# EAGLE design Turnstile_route1 (EAGLE 9.6.2)

## Sheet 1 of 3: CONNECTORS
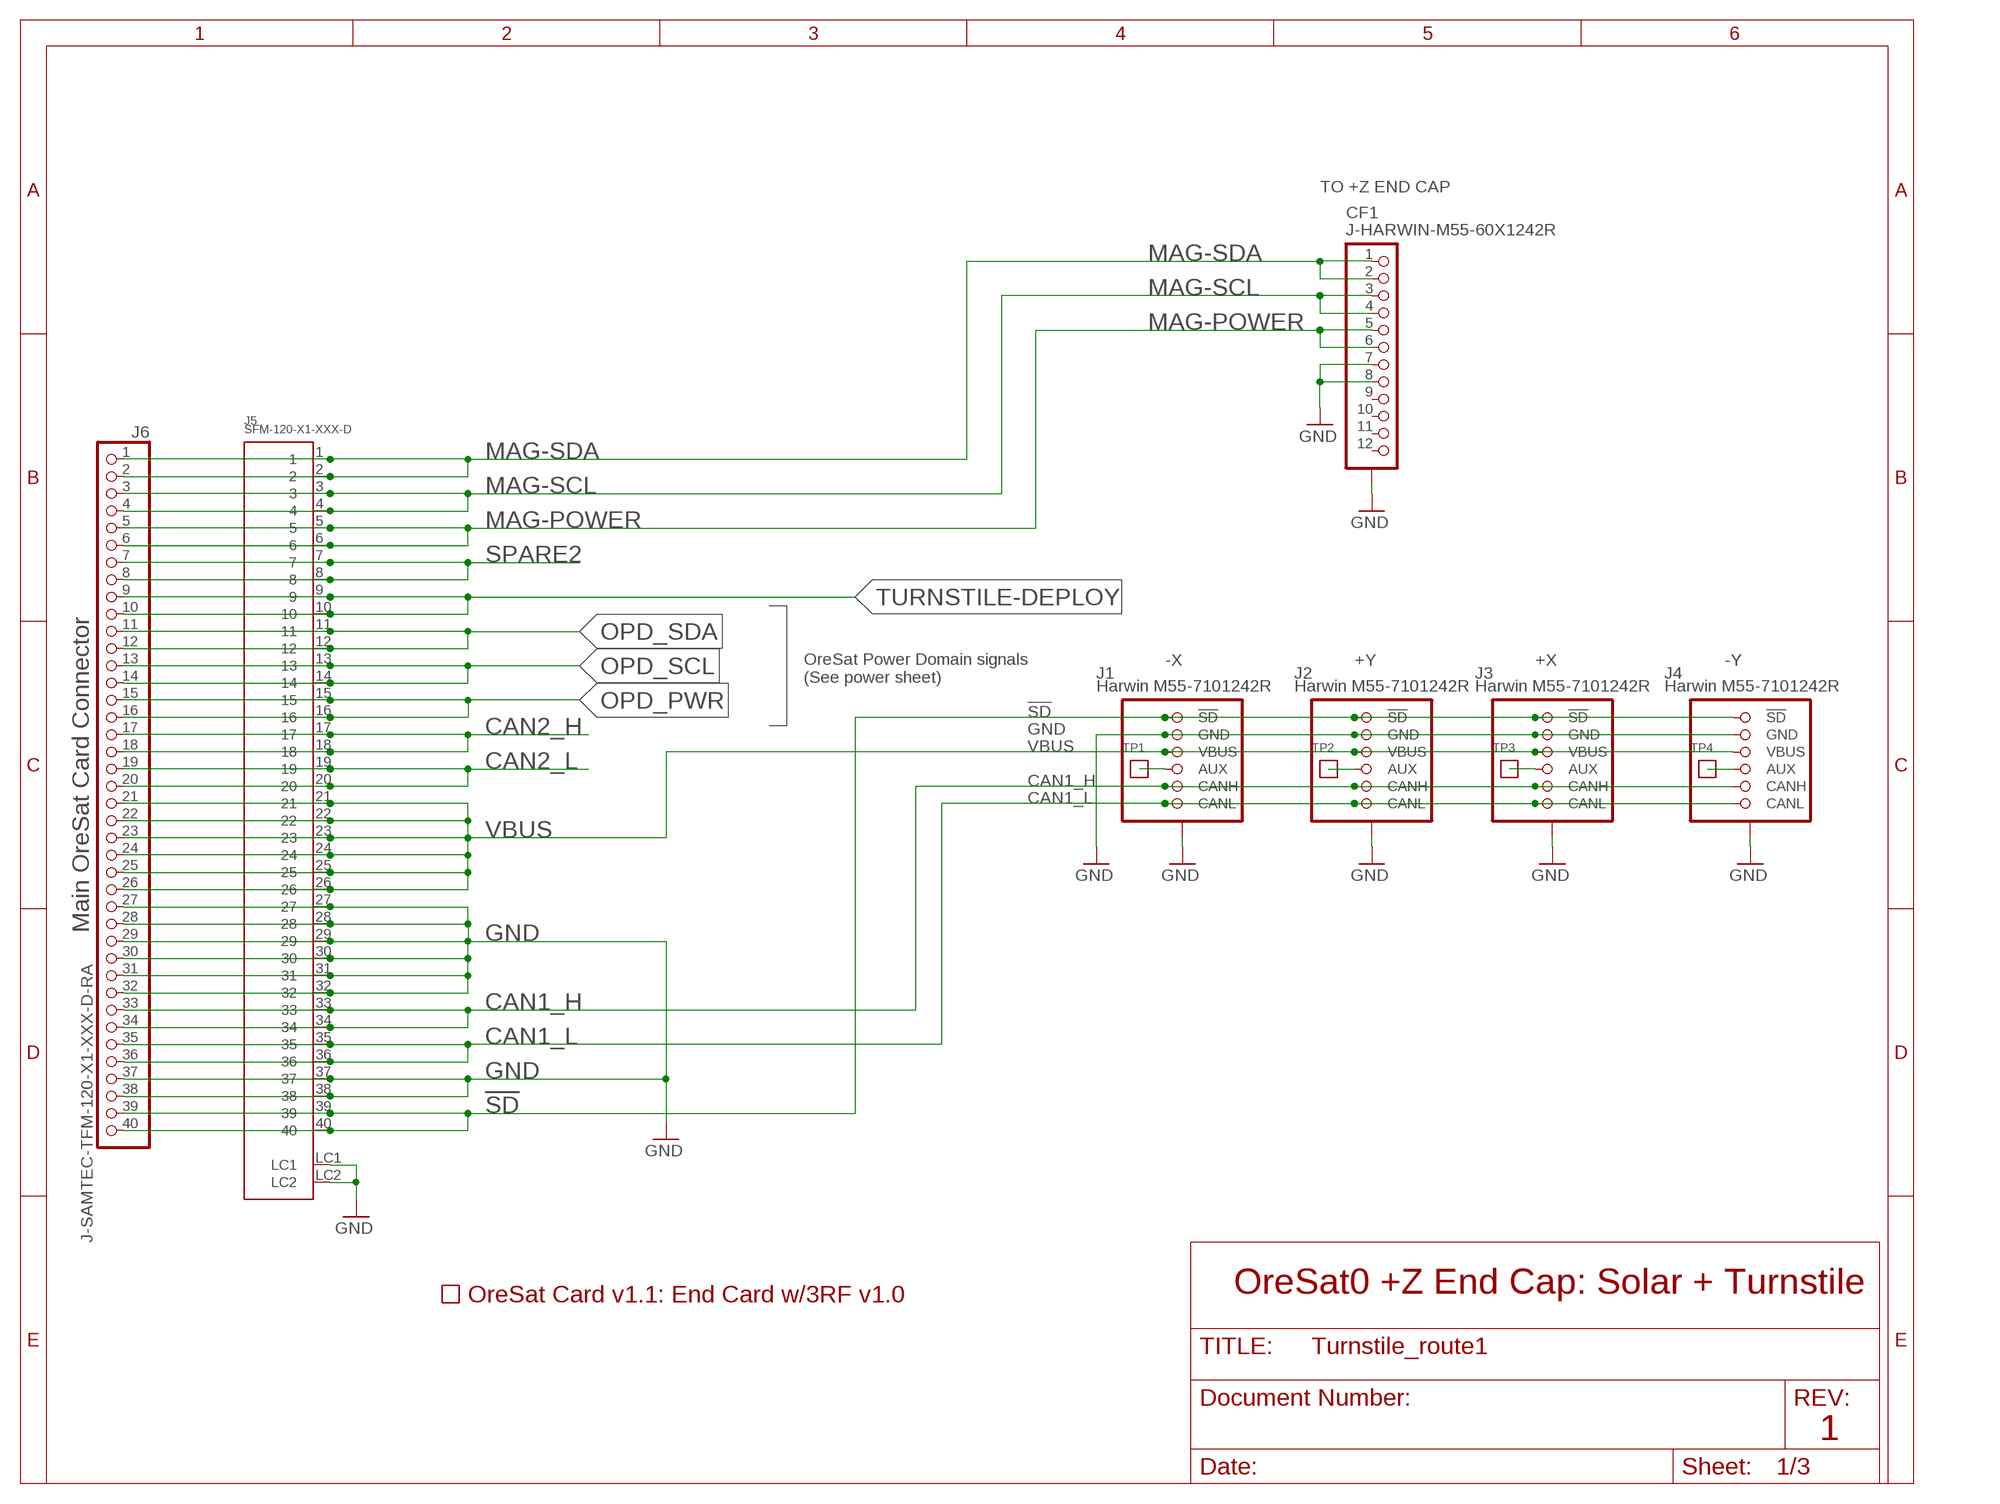
[diagram p0: schematic, sheet 1]

### Parts
CF1  J-HARWIN-M55-60X1242R  [HARWIN-M55-60X1242R]
J1  Harwin M55-7101242R  SOLAR-CARD-CONNECTOR  [M55-7101242R]
J2  Harwin M55-7101242R  SOLAR-CARD-CONNECTOR  [M55-7101242R]
J3  Harwin M55-7101242R  SOLAR-CARD-CONNECTOR  [M55-7101242R]
J4  Harwin M55-7101242R  SOLAR-CARD-CONNECTOR  [M55-7101242R]
J5  SFM-120-X1-XXX-D  [SFM-120-X1-XXX-D]
J6  J-SAMTEC-TFM-120-X1-XXX-D-RA  [J-SAMTEC-TFM-120-X1-XXX-D-RA]
PCB1  ORESAT-CARD-V1.1-END-CARD-3RF-V1.0  [ORESAT-CARDV1.1-END-CARD-3RF-V1.0]
TP1  TEST-POINT-LARGE-SQUARE  [1X01]
TP2  TEST-POINT-LARGE-SQUARE  [1X01]
TP3  TEST-POINT-LARGE-SQUARE  [1X01]
TP4  TEST-POINT-LARGE-SQUARE  [1X01]

### Nets
!SD: J1.1(!SD) J1.2(!SD) J2.1(!SD) J2.2(!SD) J3.1(!SD) J3.2(!SD) J4.1(!SD) J4.2(!SD) J5.39 J5.40 J6.39 J6.40
CAN1_H: J1.9(CANH) J1.10(CANH) J2.9(CANH) J2.10(CANH) J3.9(CANH) J3.10(CANH) J4.9(CANH) J4.10(CANH) J5.33 J5.34 J6.33 J6.34
CAN1_L: J1.11(CANL) J1.12(CANL) J2.11(CANL) J2.12(CANL) J3.11(CANL) J3.12(CANL) J4.11(CANL) J4.12(CANL) J5.35 J5.36 J6.35 J6.36
CAN2_H: J5.17 J5.18 J6.17 J6.18
CAN2_L: J5.19 J5.20 J6.19 J6.20
GND: CF1.7 CF1.8 CF1.P$1(SHIELDS) CF1.P$2(SHIELDS) CF1.P$3(SHIELDS) CF1.P$4(SHIELDS) J1.3(GND) J1.4(GND) J1.P$1(SHIELD) J1.P$2(SHIELD) J1.P$3(SHIELD) J1.P$4(SHIELD) J2.3(GND) J2.4(GND) J2.P$1(SHIELD) J2.P$2(SHIELD) J2.P$3(SHIELD) J2.P$4(SHIELD) J3.3(GND) J3.4(GND) J3.P$1(SHIELD) J3.P$2(SHIELD) J3.P$3(SHIELD) J3.P$4(SHIELD) J4.3(GND) J4.4(GND) J4.P$1(SHIELD) J4.P$2(SHIELD) J4.P$3(SHIELD) J4.P$4(SHIELD) J5.27 J5.28 J5.29 J5.30 J5.31 J5.32 J5.37 J5.38 J5.LC1 J5.LC2 J6.27 J6.28 J6.29 J6.30 J6.31 J6.32 J6.37 J6.38 ; also sheet 2,3
MAG-POWER: CF1.5 CF1.6 J5.5 J5.6 J6.5 J6.6
MAG-SCL: CF1.3 CF1.4 J5.3 J5.4 J6.3 J6.4
MAG-SDA: CF1.1 CF1.2 J5.1 J5.2 J6.1 J6.2
N$7: J1.7(AUX) J1.8(AUX) TP1.1
N$8: J2.7(AUX) J2.8(AUX) TP2.1
N$9: J3.7(AUX) J3.8(AUX) TP3.1
N$10: J4.7(AUX) J4.8(AUX) TP4.1
OPD_PWR: J5.15 J5.16 J6.15 J6.16
OPD_SCL: J5.13 J5.14 J6.13 J6.14
OPD_SDA: J5.11 J5.12 J6.11 J6.12
SPARE2: J5.7 J5.8 J6.7 J6.8
TURNSTILE-DEPLOY: J5.9 J5.10 J6.9 J6.10
VBUS: J1.5(VBUS) J1.6(VBUS) J2.5(VBUS) J2.6(VBUS) J3.5(VBUS) J3.6(VBUS) J4.5(VBUS) J4.6(VBUS) J5.21 J5.22 J5.23 J5.24 J5.25 J5.26 J6.21 J6.22 J6.23 J6.24 J6.25 J6.26
Unconnected: CF1.9 CF1.10 CF1.11 CF1.12

### Notes on the sheet
- TO +Z END CAP
- -X | +Y | +X | -Y
- OreSat Power Domain signals
  (See power sheet)
- Main OreSat Card Connector
- OreSat0 +Z End Cap: Solar + Turnstile
- 1

## Sheet 2 of 3: UHF
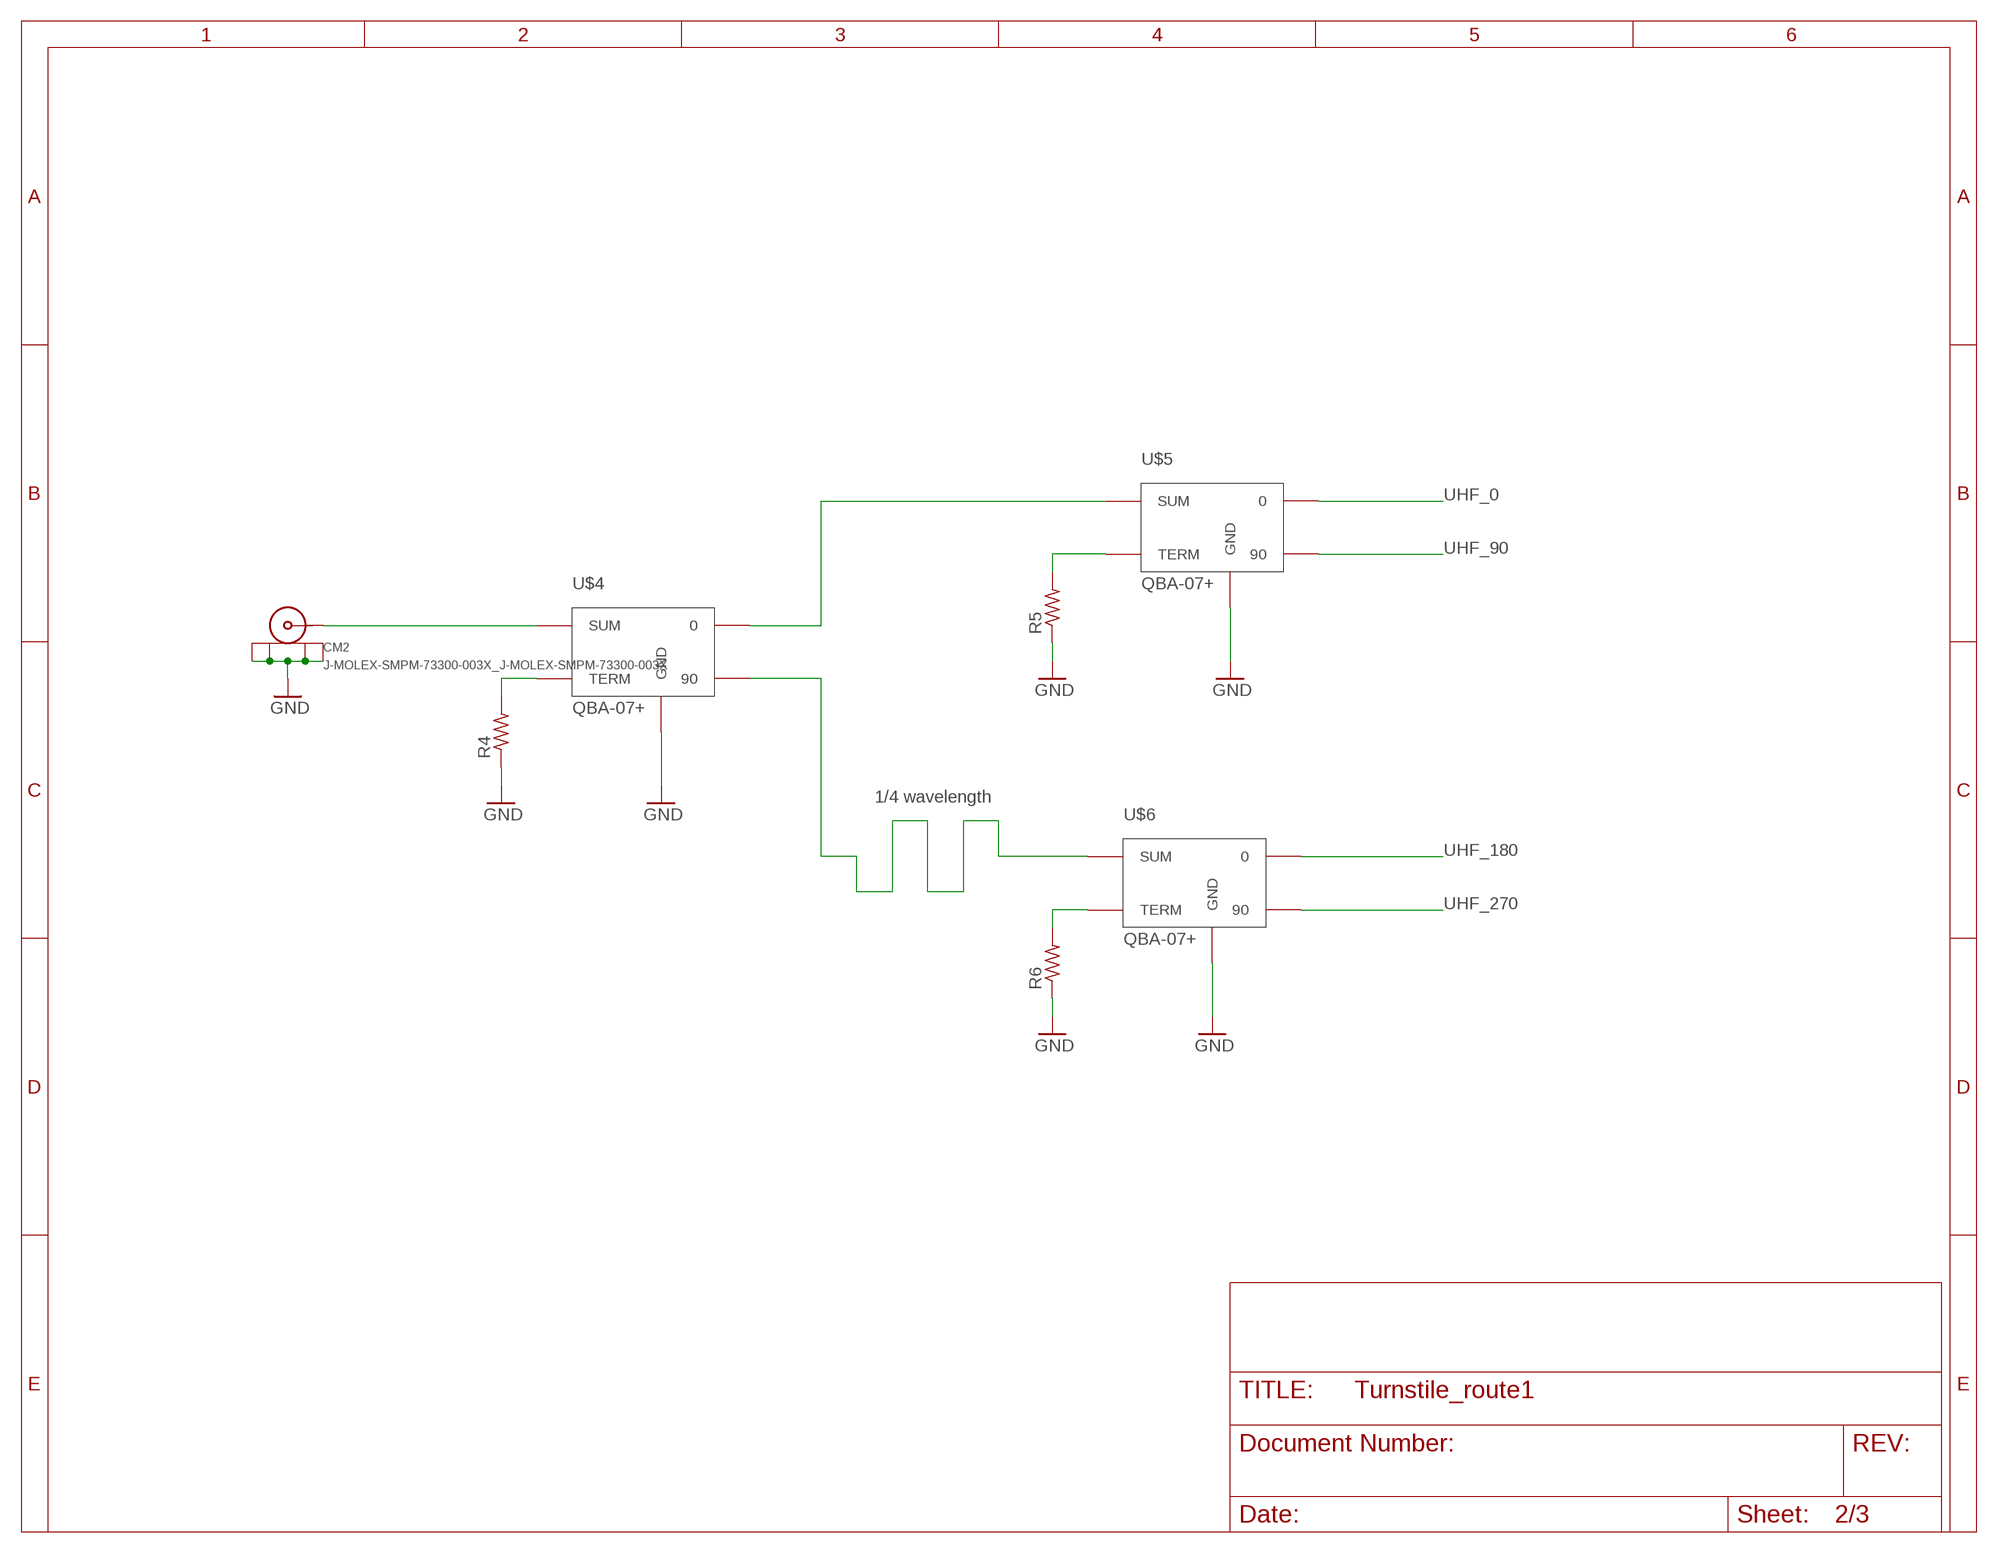
[diagram p1: schematic, sheet 2]

### Parts
CM2  J-MOLEX-SMPM-73300-003X_J-MOLEX-SMPM-73300-003X  [J-MOLEX-SMPM-73300-003X_J-MOLEX-SMPM-073300-003X]
R4  R-US_0402-A-NOSILK  [.0402-A-NOSILK]
R5  R-US_0402-A-NOSILK  [.0402-A-NOSILK]
R6  R-US_0402-A-NOSILK  [.0402-A-NOSILK]
U$4  QBA-07+  [QBA-07+]
U$5  QBA-07+  [QBA-07+]
U$6  QBA-07+  [QBA-07+]

### Nets
GND: CM2.P$1(SHIELD3) CM2.P$2(SHIELD2) CM2.P$3(SHIELD1) CM2.P$4(SHIELD) R4.1 R5.1 R6.1 U$4.P$2(GND) U$4.P$3(GND) U$4.P$4(GND) U$4.P$7(GND) U$4.P$8(GND) U$4.P$9(GND) U$4.P$11(GND) U$5.P$2(GND) U$5.P$3(GND) U$5.P$4(GND) U$5.P$7(GND) U$5.P$8(GND) U$5.P$9(GND) U$5.P$11(GND) U$6.P$2(GND) U$6.P$3(GND) U$6.P$4(GND) U$6.P$7(GND) U$6.P$8(GND) U$6.P$9(GND) U$6.P$11(GND) ; also sheet 1,3
N$19: CM2.RF(CENTER) U$4.P$1(SUM)
N$20: U$4.P$6 U$5.P$1(SUM)
N$21: R4.2 U$4.P$5(TERM)
N$22: R5.2 U$5.P$5(TERM)
N$23: U$4.P$10 U$6.P$1(SUM)
N$24: R6.2 U$6.P$5(TERM)
UHF_0: U$5.P$6
UHF_90: U$5.P$10
UHF_180: U$6.P$6
UHF_270: U$6.P$10

### Notes on the sheet
- 1/4 wavelength

## Sheet 3 of 3: L BAND
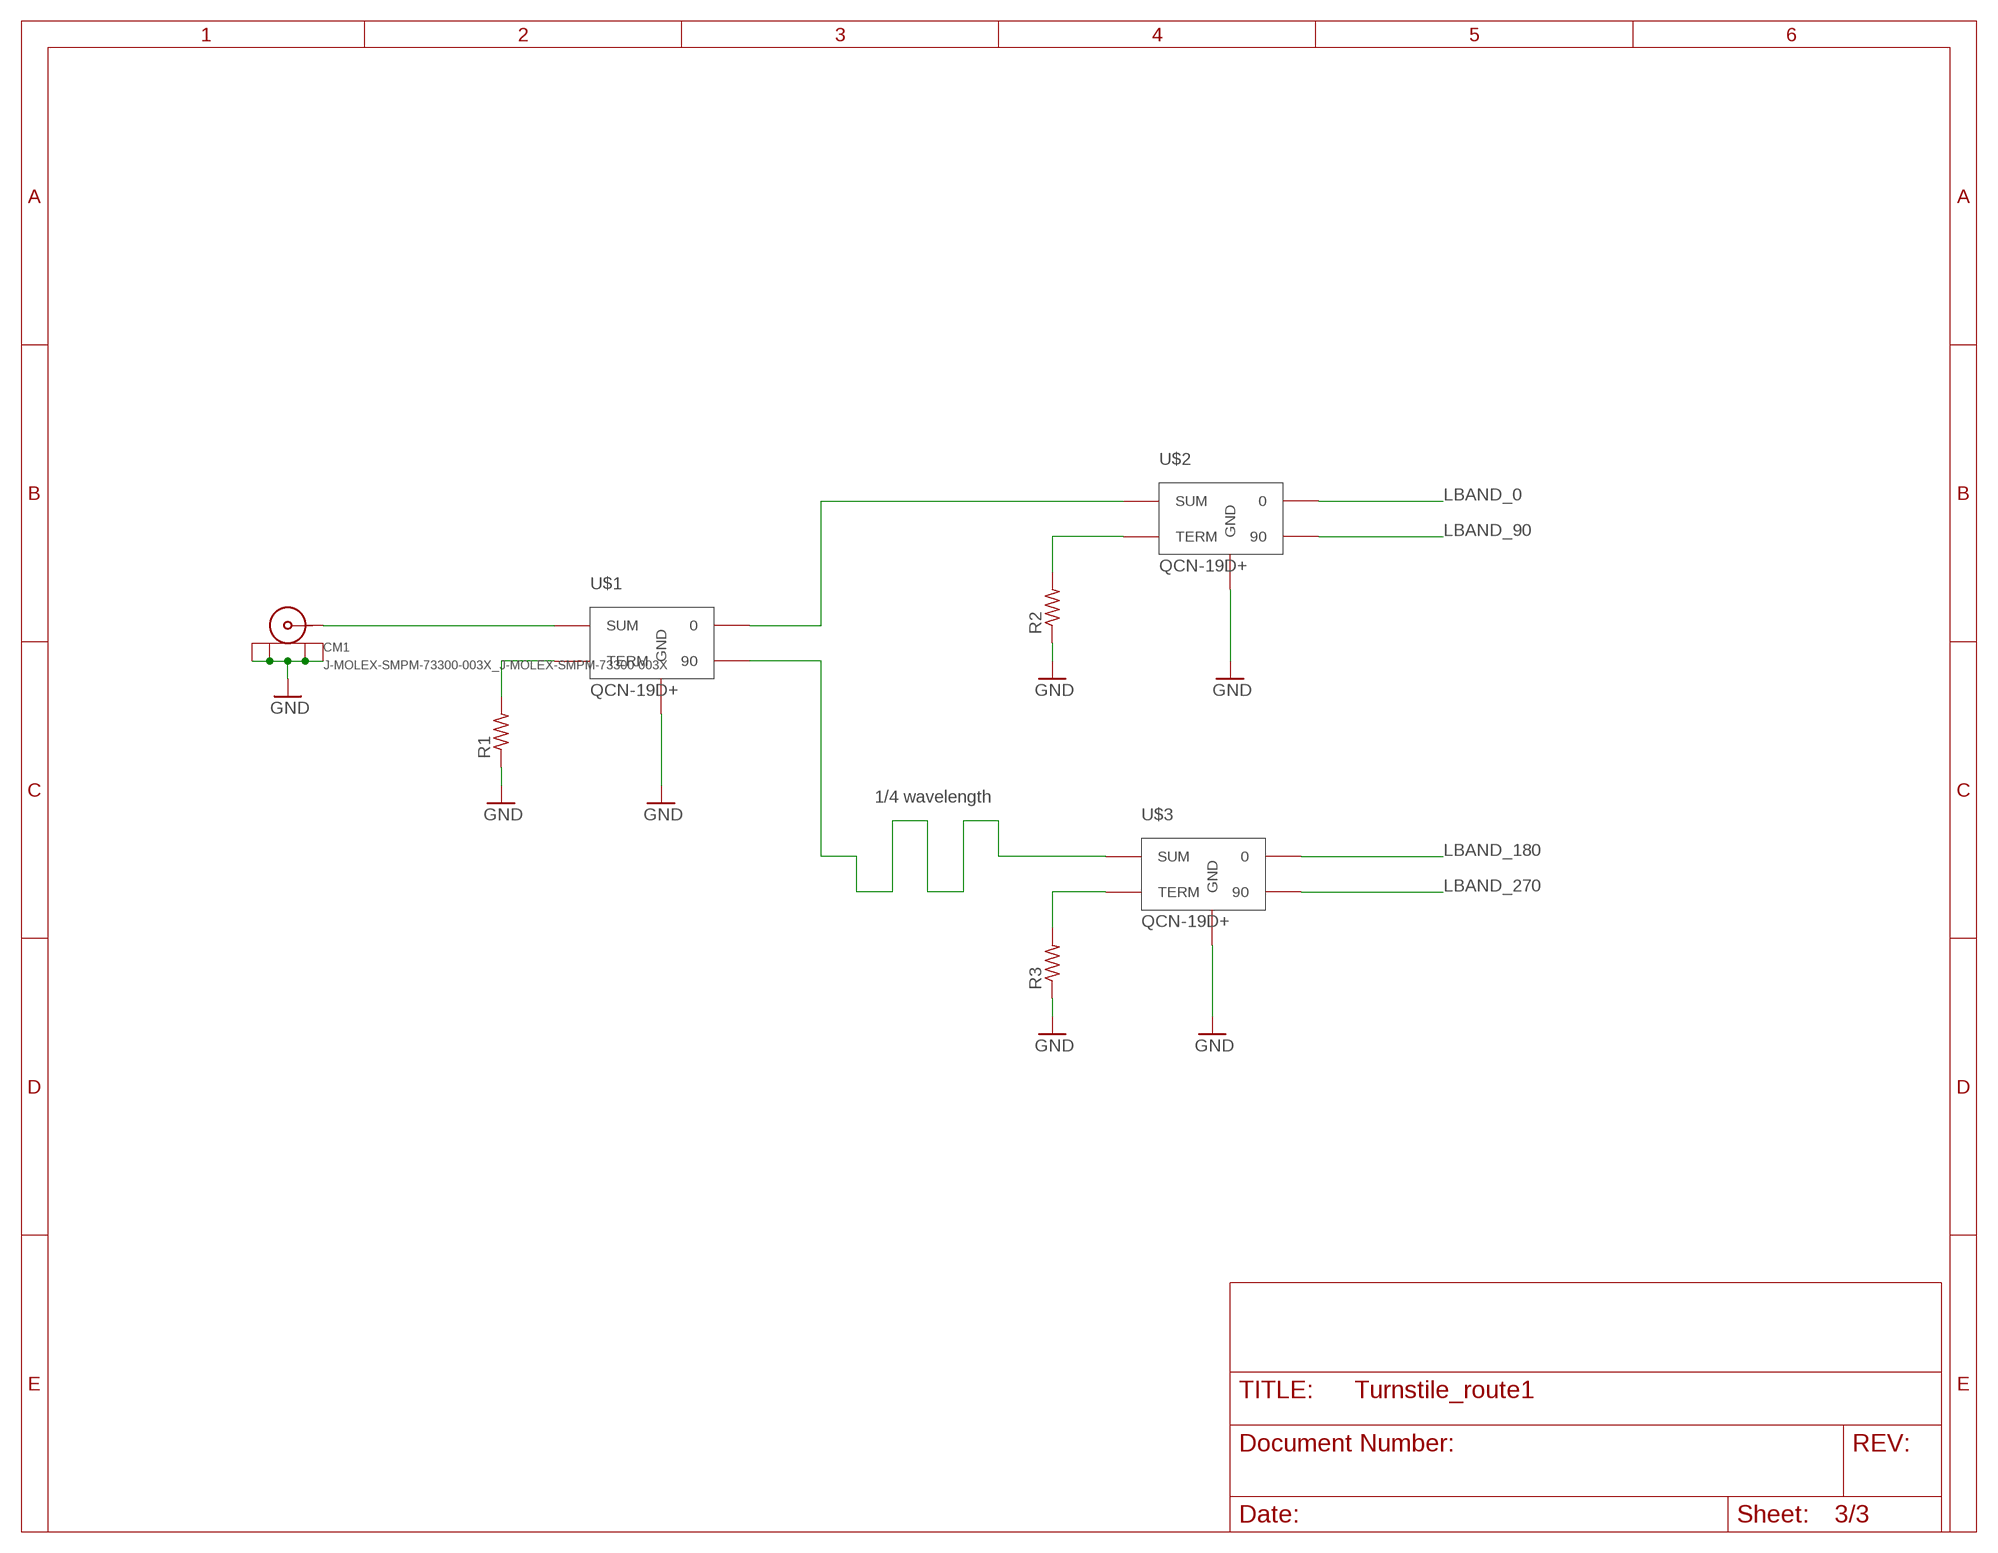
[diagram p2: schematic, sheet 3]

### Parts
CM1  J-MOLEX-SMPM-73300-003X_J-MOLEX-SMPM-73300-003X  [J-MOLEX-SMPM-73300-003X_J-MOLEX-SMPM-073300-003X]
R1  R-US_0402-A-NOSILK  [.0402-A-NOSILK]
R2  R-US_0402-A-NOSILK  [.0402-A-NOSILK]
R3  R-US_0402-A-NOSILK  [.0402-A-NOSILK]
U$1  QCN-19D+  [QVN-19D+]
U$2  QCN-19D+  [QVN-19D+]
U$3  QCN-19D+  [QVN-19D+]

### Nets
GND: CM1.P$1(SHIELD3) CM1.P$2(SHIELD2) CM1.P$3(SHIELD1) CM1.P$4(SHIELD) R1.1 R2.1 R3.1 U$1.P$2(GND) U$1.P$5(GND) U$2.P$2(GND) U$2.P$5(GND) U$3.P$2(GND) U$3.P$5(GND) ; also sheet 1,2
LBAND_0: U$2.P$4
LBAND_90: U$2.P$6
LBAND_180: U$3.P$4
LBAND_270: U$3.P$6
N$1: CM1.RF(CENTER) U$1.P$1(SUM)
N$2: U$1.P$4 U$2.P$1(SUM)
N$3: R1.2 U$1.P$3(TERM)
N$4: R2.2 U$2.P$3(TERM)
N$5: U$1.P$6 U$3.P$1(SUM)
N$6: R3.2 U$3.P$3(TERM)

### Notes on the sheet
- 1/4 wavelength

## Library data of the parts
CF1 = J-Harwin-M55-60X1242R-12pin-1.27mm-F-vertical:J-HARWIN-M55-60X1242R
CM1 CM2 = J-Molex-SMPM-73300-003X:J-MOLEX-SMPM-73300-003X_J-MOLEX-SMPM-73300-003X
J1-J4 = J-Harwin-M55-7101242-Solar-card-connector:SOLAR-CARD-CONNECTOR: OreSat End Card Solar Connector This 12pin 1.27 mm male SMT connector (Harwin M55-7101242R) is used on the end cards to attach to the solar boards. Note: alignment pin hole diameters are 0.05 mm smaller than recommended in order to tighten up connector location; this requires hand placement of this package.
J5 = J-Samtec-SFM-120-X1-XXX-D:SFM-120-X1-XXX-D: 0.05"X0.05" SOCKET STRIP DOUBLE ROW ASSEMBLY. MANUFACTURER: SAMTEC.
J6 = J-Samtec-TFM-120-X1-XXX-D-RA:J-SAMTEC-TFM-120-X1-XXX-D-RA; DIS: Digi-Key; DPN: SAM10145-ND; MFR: Samtec; MPN: TFM-120-01-L-D-RA
PCB1 = oresat-cards:ORESAT-CARD-V1.1-END-CARD-3RF-V1.0
R1-R6 = oresat-rcl:R-US_: RESISTOR, American symbol
TP1-TP4 = oresat-misc:TEST-POINT-LARGE-SQUARE
U$1-U$3 = Mini-Circuits-QCN-19D+_Phase-shifter:QCN-19D+
U$4-U$6 = Mini-Circuits-QBA-07+_Phase-shifter:QBA-07+

## Board
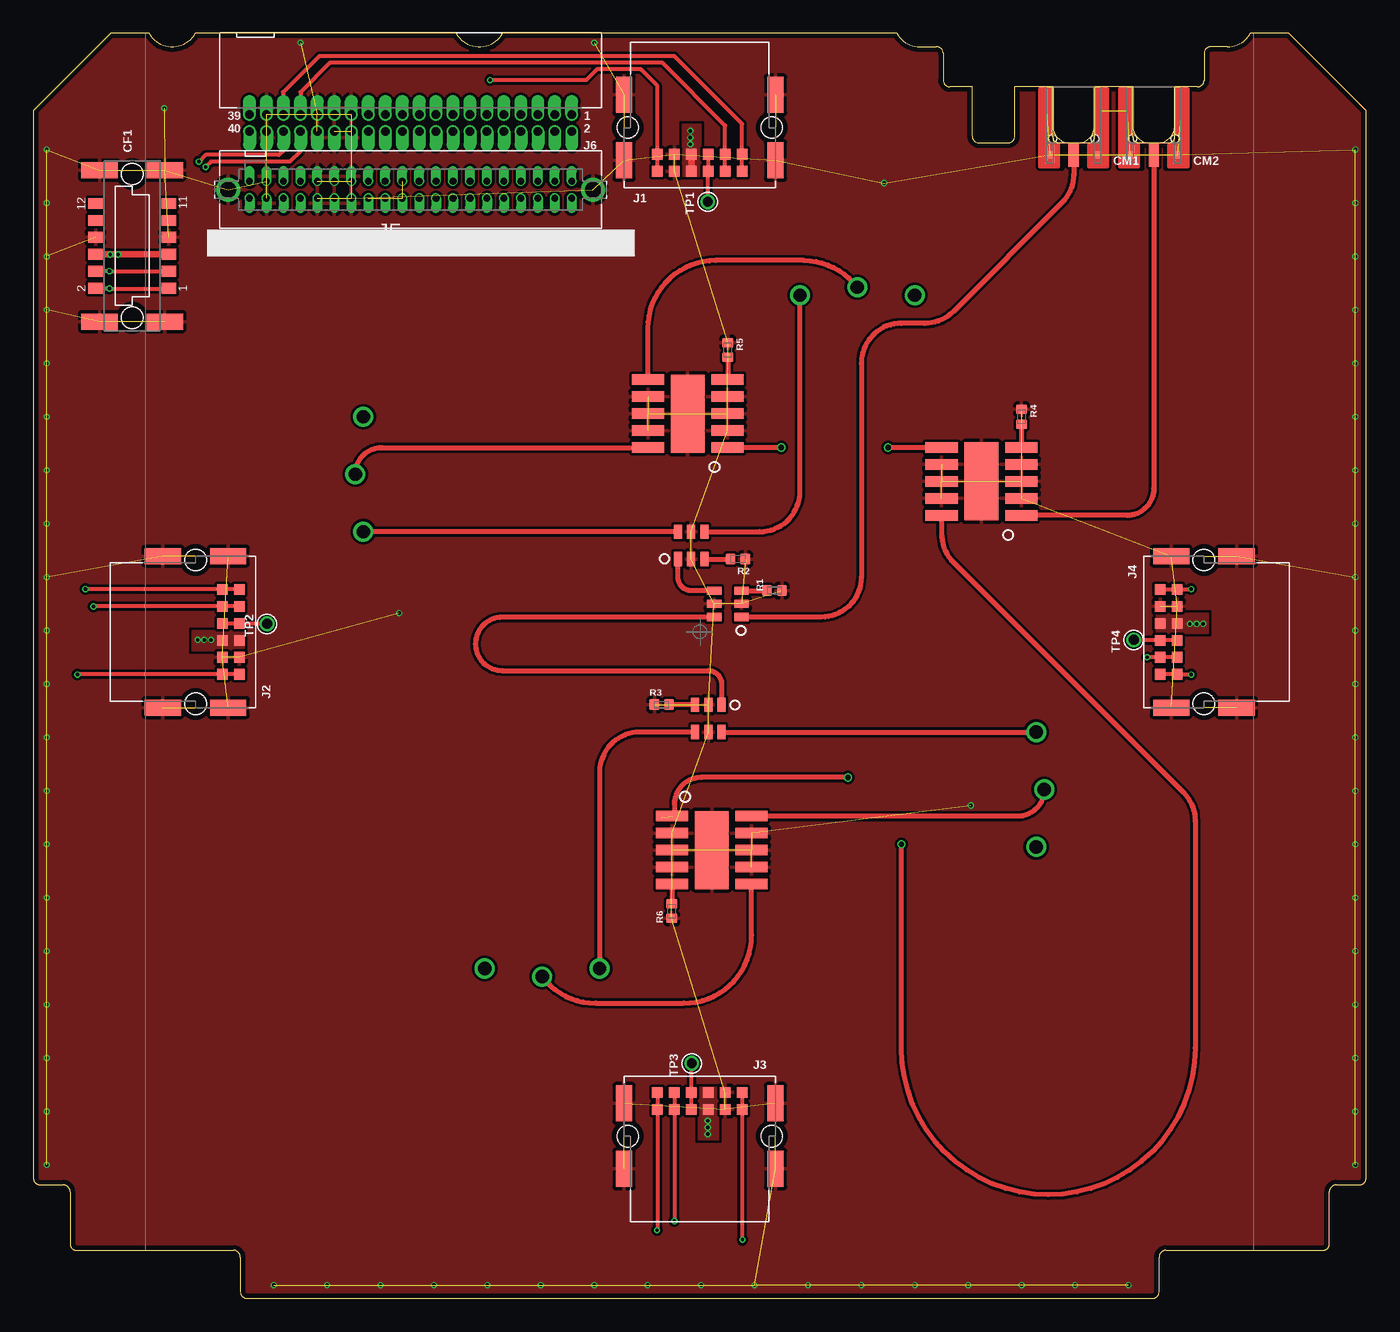
[diagram p3: board, top side]
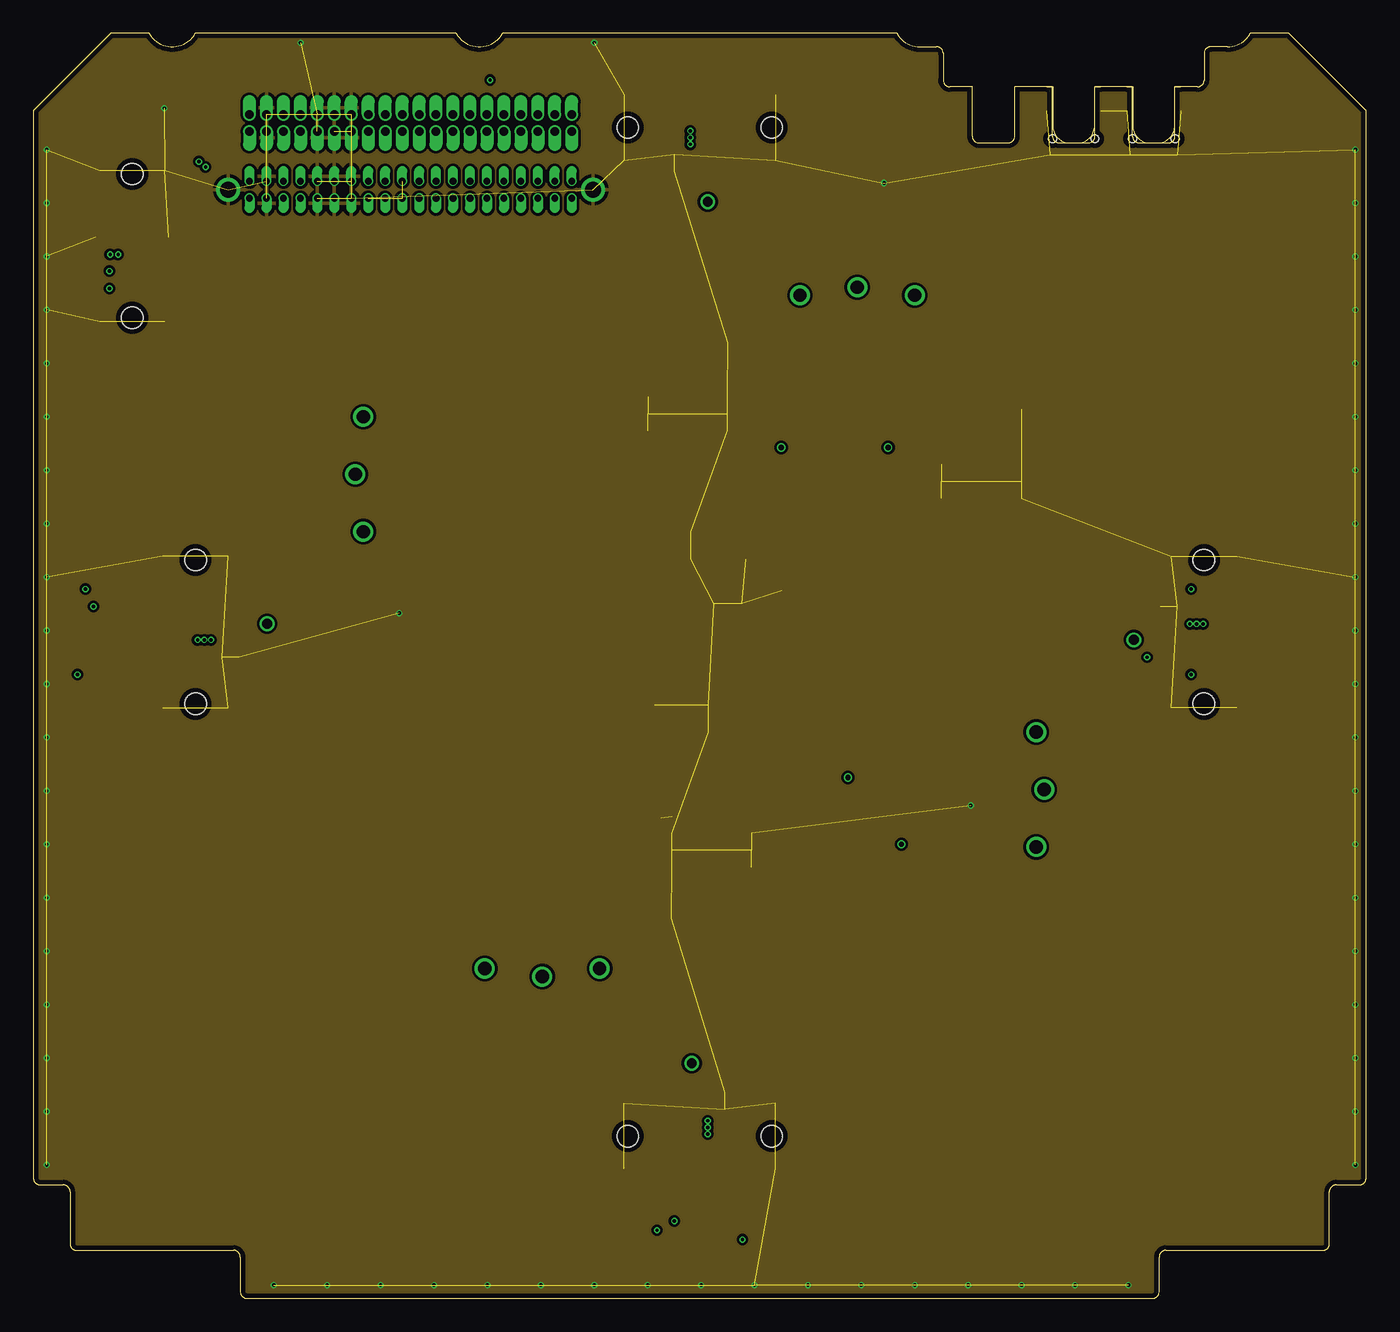
[diagram p4: board, inner layer Route2]
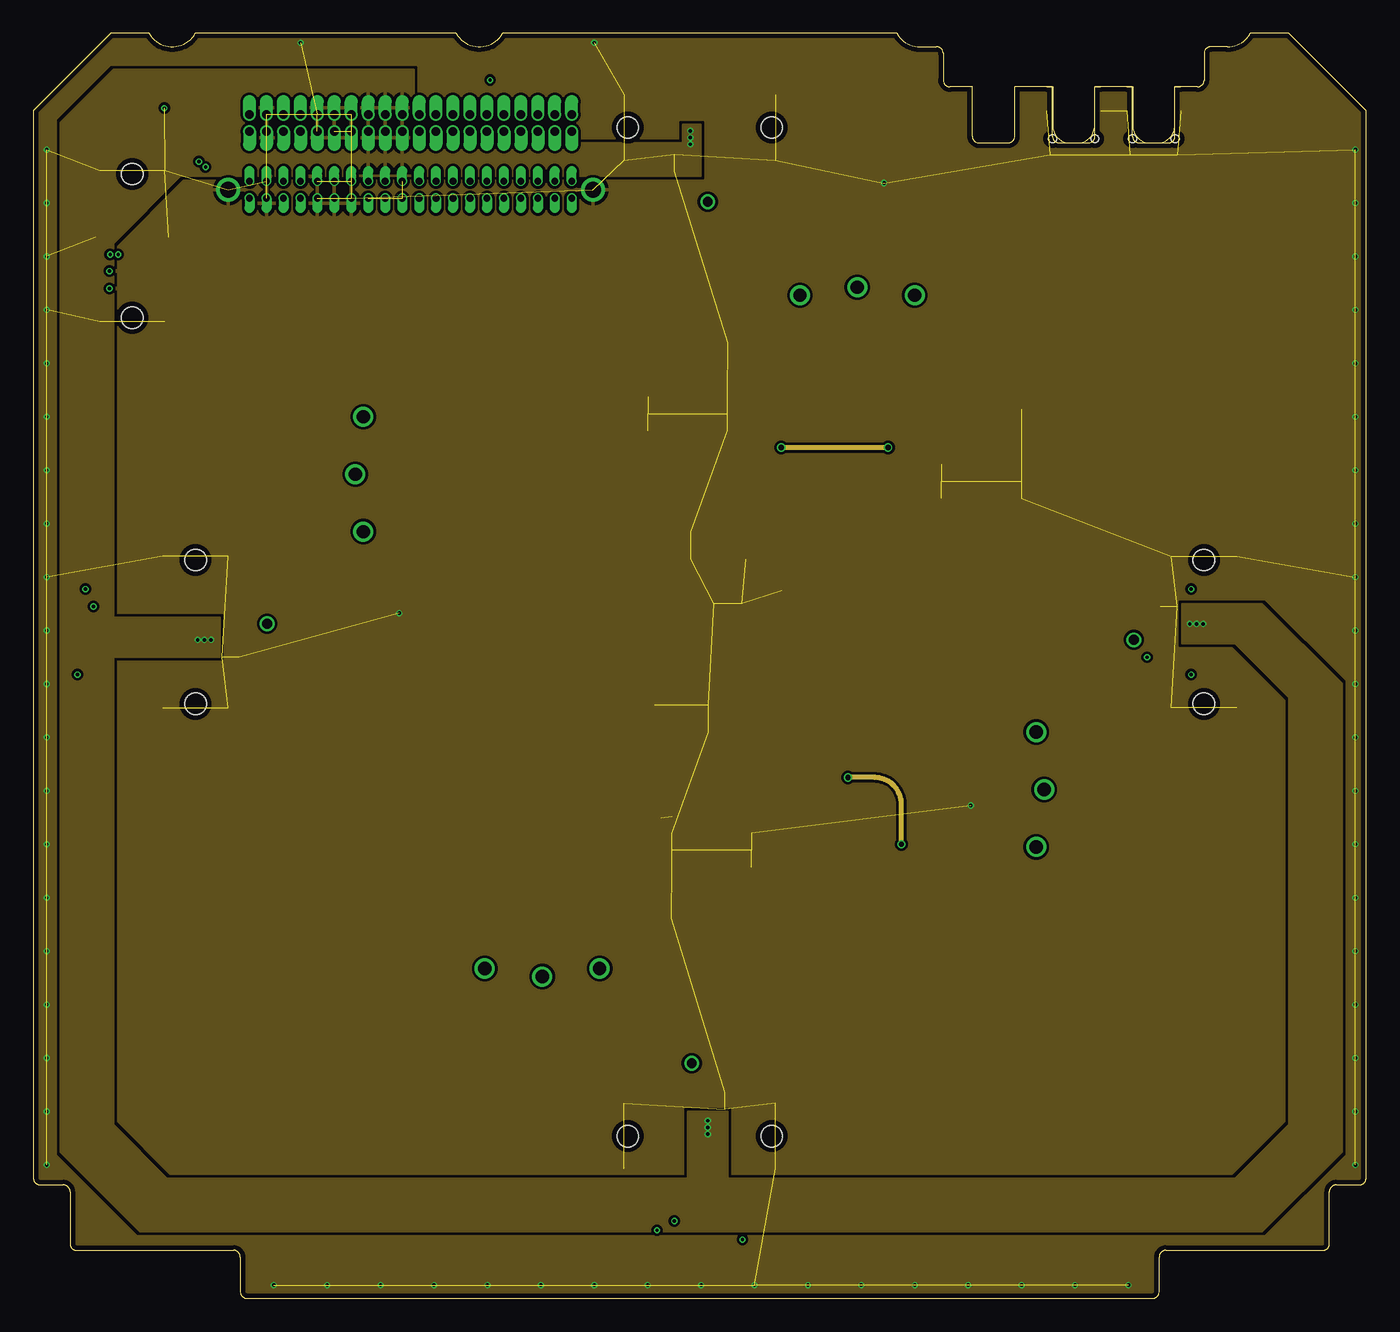
[diagram p5: board, inner layer Route15]
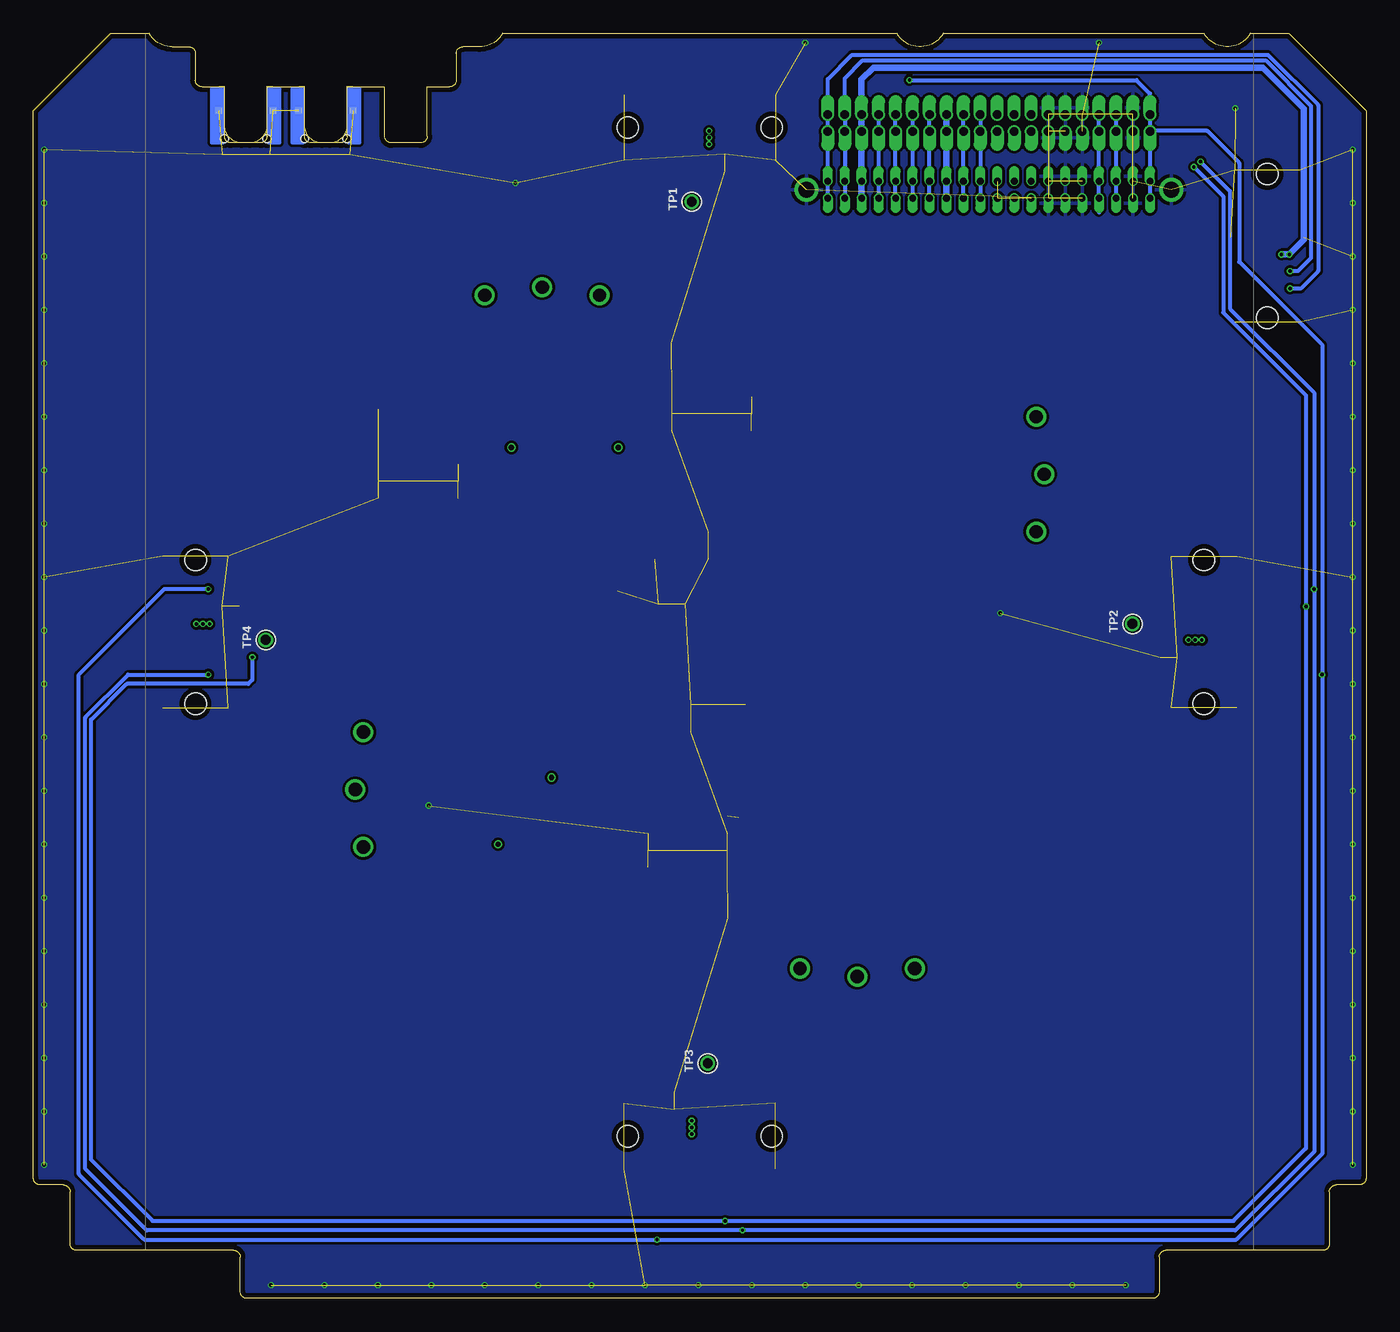
[diagram p6: board, bottom side, seen from below]

Size 99.8 x 94.7 mm. Coordinates in mm from the lower left corner, seen from the top.
Copper layers (1*2*15*16): Top 0.035559375mm / dielectric 0.17018125mm / Route2 0.01778125mm / dielectric 47mil / Route15 0.01778125mm / dielectric 0.17018125mm / Bottom 0.035559375mm
Design rules "oshpark-4layer *": minimum track width 5mil, minimum drill 10mil, track to track 5mil, track to pad 5mil, pad to pad 5mil, via to via 5mil, smd to smd 5mil, copper to edge 15mil, drill to drill 6mil, minimum pad ring 4mil, minimum via ring 4mil, stop-mask expansion 2.5mil, vias tented up to drill 10mil, thermal gap 10mil

### Footprints (pad centres in the part's own frame; a part is rotated, then mirrored left to right if it is on the bottom)
HARWIN-M55-60X1242R = smd 0.8 x 1.1: 1 -3.175,-2.75; 2 -3.175,2.75; 3 -1.905,-2.75; 4 -1.905,2.75; 5 -0.635,-2.75; 6 -0.635,2.75; 7 0.635,-2.75; 8 0.635,2.75; 9 1.905,-2.75; 10 1.905,2.75; 11 3.175,-2.75; 12 3.175,2.75 | smd 1.2 x 2.7: P$1 -5.67,-2.45; P$2 -5.67,2.45; P$3 5.67,2.45; P$4 5.67,-2.45 | hole 1.6: -5.385,0; 5.385,0
J-MOLEX-SMPM-73300-003X_J-MOLEX-SMPM-073300-003X = smd 0.508 x 0.508: P$1 -1.778,-5.08; P$2 1.778,-5.08 | smd 0.508 x 0.508 bottom: P$3 -2.032,-1.778; P$4 2.032,-1.778 | smd 0.762 x 1.778: RF 0,-5.08 | hole 0.61: 1.587,-3.886; -1.587,-3.886
M55-7101242R = smd 0.8 x 0.8: 1 3.175,2; 2 3.175,3.27; 3 1.905,2; 4 1.905,3.27; 5 0.635,2; 6 0.635,3.27; 7 -0.635,2; 8 -0.635,3.27; 9 -1.905,2; 10 -1.905,3.27; 11 -3.175,2; 12 -3.175,3.27 | smd 1.2 x 2.7: P$1 5.67,2.45; P$2 5.67,-2.45; P$3 -5.67,2.45; P$4 -5.67,-2.45 | hole 1.6: 5.385,0; -5.385,0
SFM-120-X1-XXX-D = drill 0.5 offset: 1 12.065,-0.635; 2 12.065,0.635; 3 10.795,-0.635; 4 10.795,0.635; 5 9.525,-0.635; 6 9.525,0.635; 7 8.255,-0.635; 8 8.255,0.635; 9 6.985,-0.635; 10 6.985,0.635; 11 5.715,-0.635; 12 5.715,0.635; 13 4.445,-0.635; 14 4.445,0.635; 15 3.175,-0.635; 16 3.175,0.635; 17 1.905,-0.635; 18 1.905,0.635; 19 0.635,-0.635; 20 0.635,0.635; 21 -0.635,-0.635; 22 -0.635,0.635; 23 -1.905,-0.635; 24 -1.905,0.635; 25 -3.175,-0.635; 26 -3.175,0.635; 27 -4.445,-0.635; 28 -4.445,0.635; 29 -5.715,-0.635; 30 -5.715,0.635; 31 -6.985,-0.635; 32 -6.985,0.635; 33 -8.255,-0.635; 34 -8.255,0.635; 35 -9.525,-0.635; 36 -9.525,0.635; 37 -10.795,-0.635; 38 -10.795,0.635; 39 -12.065,-0.635; 40 -12.065,0.635 | drill 1.194: LC1 13.652,0; LC2 -13.652,0
J-SAMTEC-TFM-120-X1-XXX-D-RA = drill 0.635 pad 0.965 offset: 1 12.065,0.635; 2 12.065,-0.635; 3 10.795,0.635; 4 10.795,-0.635; 5 9.525,0.635; 6 9.525,-0.635; 7 8.255,0.635; 8 8.255,-0.635; 9 6.985,0.635; 10 6.985,-0.635; 11 5.715,0.635; 12 5.715,-0.635; 13 4.445,0.635; 14 4.445,-0.635; 15 3.175,0.635; 16 3.175,-0.635; 17 1.905,0.635; 18 1.905,-0.635; 19 0.635,0.635; 20 0.635,-0.635; 21 -0.635,0.635; 22 -0.635,-0.635; 23 -1.905,0.635; 24 -1.905,-0.635; 25 -3.175,0.635; 26 -3.175,-0.635; 27 -4.445,0.635; 28 -4.445,-0.635; 29 -5.715,0.635; 30 -5.715,-0.635; 31 -6.985,0.635; 32 -6.985,-0.635; 33 -8.255,0.635; 34 -8.255,-0.635; 35 -9.525,0.635; 36 -9.525,-0.635; 37 -10.795,0.635; 38 -10.795,-0.635; 39 -12.065,0.635; 40 -12.065,-0.635
.0402-A-NOSILK = smd 0.7 x 0.8: 1 -0.55,0; 2 0.55,0
1X01 = drill 0.737 pad 1.1: 1 0,0
QVN-19D+ = smd 0.61 x 1.07: P$1 -0.99,-1.025; P$2 0,-1.025; P$3 0.99,-1.025; P$4 0.99,1.025; P$5 0,1.025; P$6 -0.99,1.025
QBA-07+ = smd 0.79 x 2.41: P$1 -2.54,-2.985; P$2 -1.27,-2.985; P$3 0,-2.985; P$4 1.27,-2.985; P$5 2.54,-2.985; P$6 2.54,2.985; P$7 1.27,2.985; P$8 0,2.985; P$9 -1.27,2.985; P$10 -2.54,2.985 | smd 5.84 x 2.54: P$11 0,0

### Placement (x,y rotation side)
CF1  7.4,78.8 90 top
CM1  77.9,90.7 0 top
CM2  83.9,90.7 0 top
J1  49.9,87.65 180 top
J2  12.15,49.9 270 top
J3  49.9,12.15 0 top
J4  87.65,49.9 90 top
J5  28.25,83 0 top
J6  28.25,88 0 top
PCB1  0,0 0 top
R1  55.5,52.99 180 top
R2  52.76,55.35 180 top
R3  47.04,44.45 0 top
R4  74,66 270 top
R5  52,71 270 top
R6  47.8,29 90 top
TP1  50.5,82.1 90 top
TP2  17.5,50.5 90 top
TP3  49.3,17.6 90 top
TP4  82.4,49.3 90 top
U$1  52,52 90 top
U$2  49.26,56.38 0 top
U$3  50.54,43.42 180 top
U$4  71,61.16 90 top
U$5  49,66.24 90 top
U$6  50.8,33.56 270 top

### Tracks (layer width: path | path; a pad name or v marks a point on that pad's centre or on a via)
!SD  (via drill 0.25)
  Top 0.3: J1.2 J1.1 46.73,90.78 45.5,92 42.2,92 41.4,91.2 v34.2,91.2 | J2.2 J2.1 3.33,46.73 v3.3,46.7 | J3.2 J3.1 53.08,4.3 53.1,4.3 v53.1,4.4 | J4.2 J4.1 86.7,53.08 v86.7,53.1
  Bottom 0.3: J6.40 J6.39 16.18,90.19 17.2,91.2 v34.2,91.2 | J6.40 J5.40 J5.39 | v86.7,53.1 90,53.1 96.4,46.7 96.4,9.3 91.5,4.4 v53.1,4.4 9.73,4.4 3.3,10.83 v3.3,46.7 3.3,71.4 9.5,77.6 9.5,85 11.9,87.4 16.15,87.4 J6.40
CAN1_H  (via drill 0.25)
  Top 0.3: J1.10 J1.9 51.8,87.8 47.1,92.5 22.2,92.5 20,90.3 J6.33 | J2.10 J2.9 v4.5,51.8 | J3.10 J3.9 v47.99,5.8 v48,5.8 | J4.9 J4.10 v83.4,47.99 v83.4,48 | J6.34 20,85.89 19.2,85.1 13.3,85.1 v12.9,84.7
  Bottom 0.3: J6.33 J6.34 J5.34 J5.33 20,81.3 | v83.4,48 83.4,46.3 83.7,46 92.8,46 95.47,43.32 95.47,10.4 90.87,5.8 v48,5.8 9.93,5.8 4.5,11.23 v4.5,51.8 4.5,67.6 10.7,73.8 10.7,82.5 v12.9,84.7
CAN1_L  (via drill 0.25)
  Top 0.3: J1.12 J1.11 53.08,87.92 48,93 21.4,93 18.7,90.3 18.7,88.66 J6.35 | J2.12 J2.11 3.92,53.08 v3.9,53.1 | J3.12 J3.11 46.73,5.11 v46.7,5.11 | v86.7,46.7 85.65,46.7 J4.11 J4.12 | J6.36 18.73,85.92 18.4,85.6 12.9,85.6 v12.4,85.1
  Bottom 0.3: J6.35 J6.36 J5.36 J5.35 | v86.7,46.7 92.7,46.7 95.9,43.5 95.9,9.7 91.3,5.1 v46.7,5.1 | v46.7,5.1 9.8,5.1 3.9,11 v3.9,53.1 3.9,67.8 10.2,74.1 10.2,82.9 v12.4,85.1 | v46.7,5.11 v46.7,5.1
CAN2_H
  Bottom 0.3: J5.17 J5.18 J6.18 J6.17
CAN2_L
  Bottom 0.3: J6.19 J6.20 J5.20 J5.19
GND  (via drill 0.25)  (151 unrouted)
  other vias: 1,10 1,14 1,18 1,22 1,26 1,30 1,34 1,38 1,42 1,46 1,50 1,54 1,58 1,62 1,66 1,70 1,74 1,78 1,82 1,86 99,10 99,14 99,18 99,22 99,26 99,30 99,34 99,38 99,42 99,46 99,50 99,54 99,58 99,62 99,66 99,70 99,74 99,78 99,82 99,86 18,1 22,1 26,1 30,1 34,1 38,1 42,1 46,1 50,1 54,1 58,1 62,1 66,1 70,1 74,1 78,1 82,1 27.4,51.3 70.2,36.9 63.7,83.5 9.8,89.1 20,94 42,94
  pour Top (isolate 0.2, rank 6): 0,0 0,94.7 99.8,94.7 99.8,0
  pour Bottom (isolate 0.2, rank 6): 0,0 0,94.7 99.8,94.7 99.8,0
  pour Route2 (isolate 0.2, rank 6): 0,0 0,94.7 99.8,94.7 99.8,0
  pour Route15 (isolate 0.2, rank 6): 0,0 0,94.7 99.8,94.7 99.8,0
LBAND_0  (via drill 1)
  Top 0.38: U$2.P$4 54.4,57.4 arc90 57.4,60.4 v57.4,75.1
LBAND_90  (via drill 1)
  Top 0.38: U$2.P$6 v24.7,57.4
LBAND_180  (via drill 1)
  Top 0.38: U$3.P$4 45.4,42.4 arc90 42.4,39.4 v42.4,24.7
LBAND_270  (via drill 1)
  Top 0.38: U$3.P$6 v75.1,42.4
MAG-POWER  (via drill 0.25)
  Top 0.5: CF1.5 10.13,78.15 v5.75,78.15 4.67,78.15 CF1.6
  Bottom 0.5: J5.5 J5.6 J6.6 J6.5 37.77,91.27 36.9,92.15 22.2,92.15 21.9,92.15 7.75,92.15 4.65,89.06 4.65,79.25 v5.75,78.15 v6.35,78.15
MAG-SCL  (via drill 0.25)
  Top 0.3: CF1.4 v5.7,76.9 CF1.3
  Bottom 0.3: J5.3 J5.4 J6.4 J6.3 39.05,91.33 37.7,92.67 22.2,92.67 7.53,92.67 4.13,89.27 4.13,77.87 5.1,76.9 v5.7,76.9
MAG-SDA  (via drill 0.25)
  Top 0.3: CF1.2 4.67,75.6 v5.7,75.6 10.12,75.6 CF1.1
  Bottom 0.3: J5.1 J5.2 J6.2 J6.1 40.31,91.28 38.5,93.1 7.35,93.1 3.6,89.35 3.6,76.9 4.9,75.6 v5.7,75.6
N$1
  Top 0.38: CM1.RF 77.9,84.14 arc-45 77.02,82.02 68.88,73.88 arc-45 66.76,73 65,73 arc90 62,70 62,54.01 arc-90 59,51.01 U$1.P$1
N$2
  Top 0.38: U$1.P$4 49.27,52.99 arc-90 48.27,53.99 U$2.P$1
N$3
  Top 0.38: U$1.P$3 R1.2
N$4
  Top 0.38: U$2.P$3 R2.2
N$5
  Top 0.38: U$1.P$6 35.11,51 arc180 35.11,47 50.53,47 arc-90 51.53,46 U$3.P$1
N$6
  Top 0.38: U$3.P$3 R3.2
N$7
  Top 0.3: J1.7 J1.8 50.5,84.34 TP1.1
N$8
  Top 0.3: J2.7 J2.8 17.46,50.53 TP2.1
N$9
  Top 0.3: J3.7 J3.8 49.27,17.6 TP3.1
N$10
  Top 0.3: J4.7 J4.8 82.4,49.27 TP4.1
N$11  (via drill 1)
  other vias: 66,75.1
N$14  (via drill 1)
  other vias: 33.8,24.7
N$17  (via drill 1)
  other vias: 75.1,33.8
N$19
  Top 0.38: CM2.RF 83.9,60.62 arc-90 81.9,58.62 U$4.P$1
N$20  (via drill 0.4)
  Top 0.38: U$4.P$6 v64,63.7 | v56,63.7 U$5.P$1
  Route15 0.38: v64,63.7 v56,63.7
N$21
  Top 0.38: R4.2 74,63.72 arc-90 U$4.P$5
N$22
  Top 0.38: R5.2 52,68.8 arc-90 U$5.P$5
N$23  (via drill 0.4)  (1 unrouted)
  Top 0.38: U$4.P$10 68.02,57.23 arc45 68.89,55.11 86.12,37.88 arc-45 87,35.76 87,18.77 arc-180 65,18.77 v65,34 | 47,36 48,36 48,37 arc-90 50,39 v61,39
  Route15 0.38: v65,34 65,37 arc90 63,39 v61,39
N$24
  Top 0.38: U$6.P$5 47.81,29.57 arc-90 R6.2
N$26  (via drill 1)
  other vias: 24.7,66
OPD_PWR
  Bottom 0.5: J6.15 J6.16 J5.16 J5.15
OPD_SCL
  Bottom 0.3: J5.13 J5.14 J6.14 J6.13
OPD_SDA
  Bottom 0.3: J6.11 J6.12 J5.12 J5.11
SPARE2
  Bottom 0.3: J6.7 J6.8 J5.8 J5.7
TURNSTILE-DEPLOY
  Bottom 0.3: J5.9 J5.10 J6.10 J6.9
UHF_0  (via drill 1)
  Top 0.38: v61.7,75.7 arc53 57.7,77.7 51.09,77.7 arc90 46,72.61 46,68.8 arc90 U$5.P$6
UHF_90  (via drill 1)
  Top 0.38: v24.1,61.7 arc-90 26.1,63.7 U$5.P$10
UHF_180  (via drill 1)
  Top 0.38: v38.1,24.1 arc53 42.1,22.1 48.69,22.1 arc90 53.78,27.19 U$6.P$6
UHF_270  (via drill 1)
  Top 0.38: v75.7,38.1 arc-90 73.7,36.1 U$6.P$10
VBUS  (via drill 0.25)  (3 unrouted)
  Top 0.5: J1.6 J1.5
  other vias: 49.2,86.4 49.2,86.9 49.2,87.4 13.3,49.3 12.8,49.3 12.3,49.3 86.6,50.5 87.1,50.5 87.6,50.5 50.5,13.3 50.5,12.8 50.5,12.3
  pour Route15 (isolate 0.2): 2,88 6,92 28.5,92 28.5,86.5 48.6,86.5 48.6,87.9 50,87.9 50,84 11,84 6,79 6,51 14,51 14,48 6,48 6,13 10,9 49,9 49,14 52,14 52,9 90,9 94,13 94,45 90,49 86,49 86,52 92,52 98,46 98,11 92,5 8,5 2,11
  pour Top (isolate 0.2, no thermals): 50,84 50,87.9 48.6,87.9 48.6,84
  pour Top (isolate 0.2, no thermals): 15.8,50 11.9,50 11.9,48.5 15.8,48.5
  pour Top (isolate 0.2, no thermals): 84.1,49.8 88,49.8 88,51.3 84.1,51.3
  pour Top (isolate 0.2, no thermals): 49.8,15.8 49.8,11.9 51.3,11.9 51.3,15.8